# Altium schematic sheet Main.SchDoc
size D; SheetNumber: 1; SheetTotal: 17
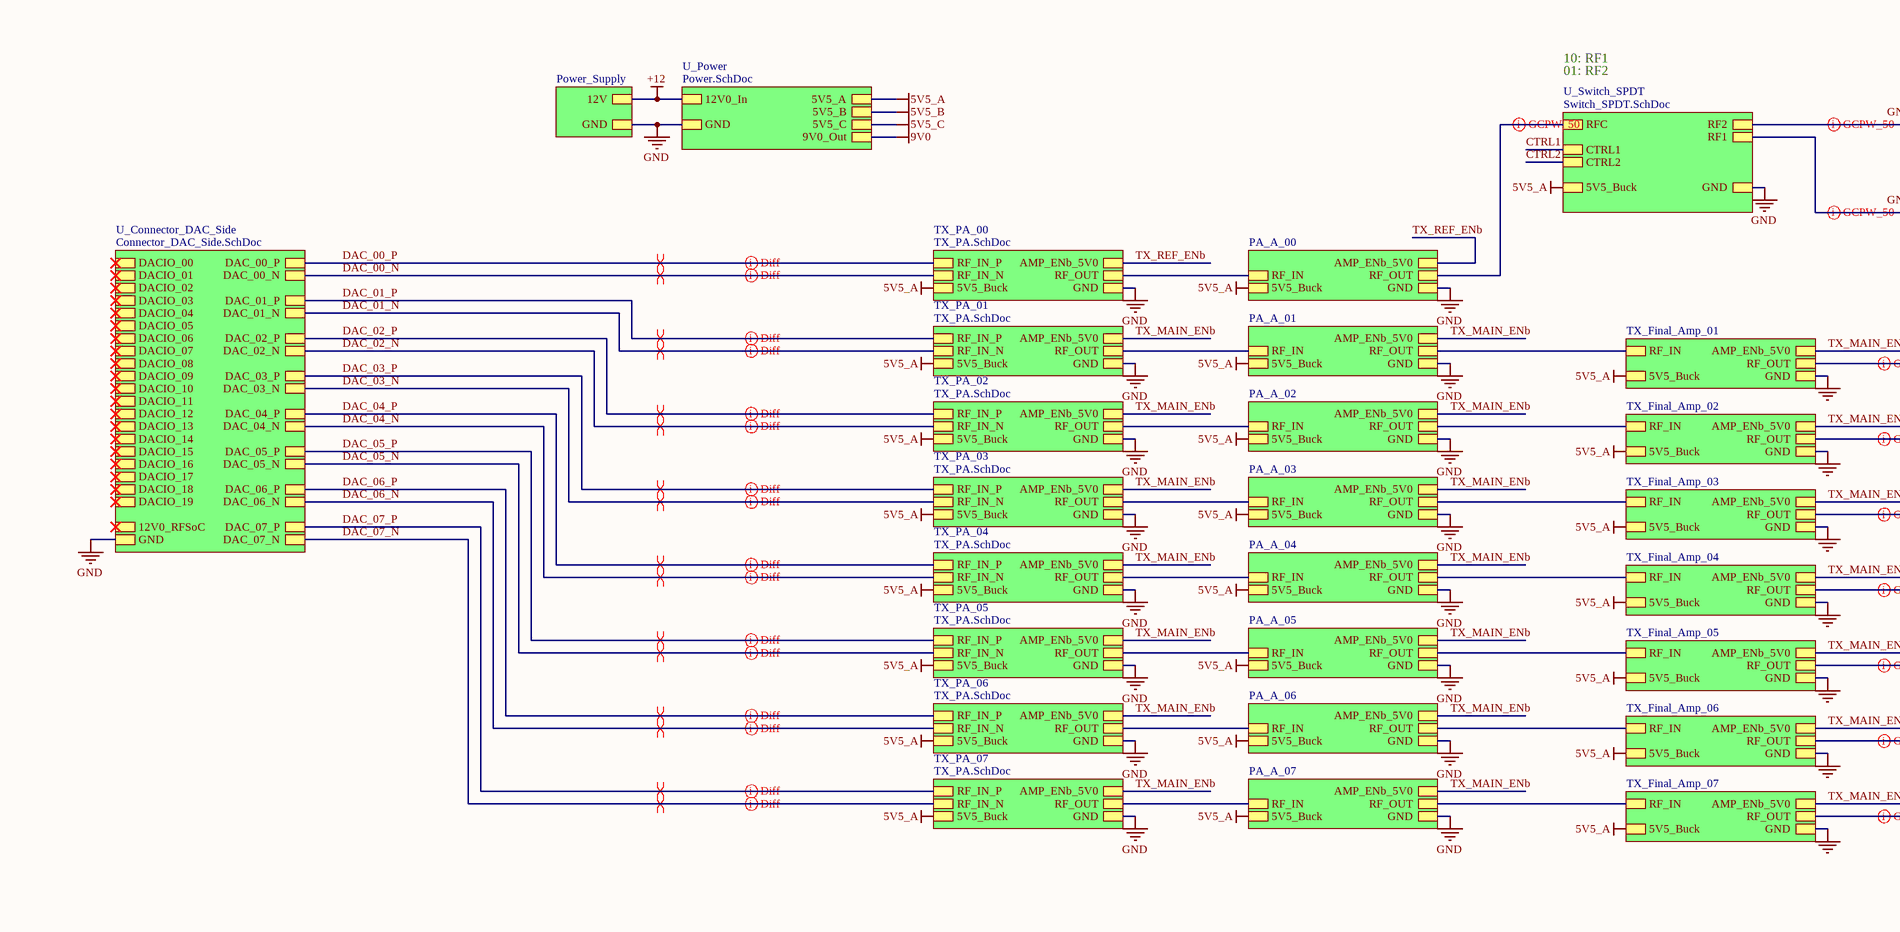
[diagram p0: Main.SchDoc, top left]
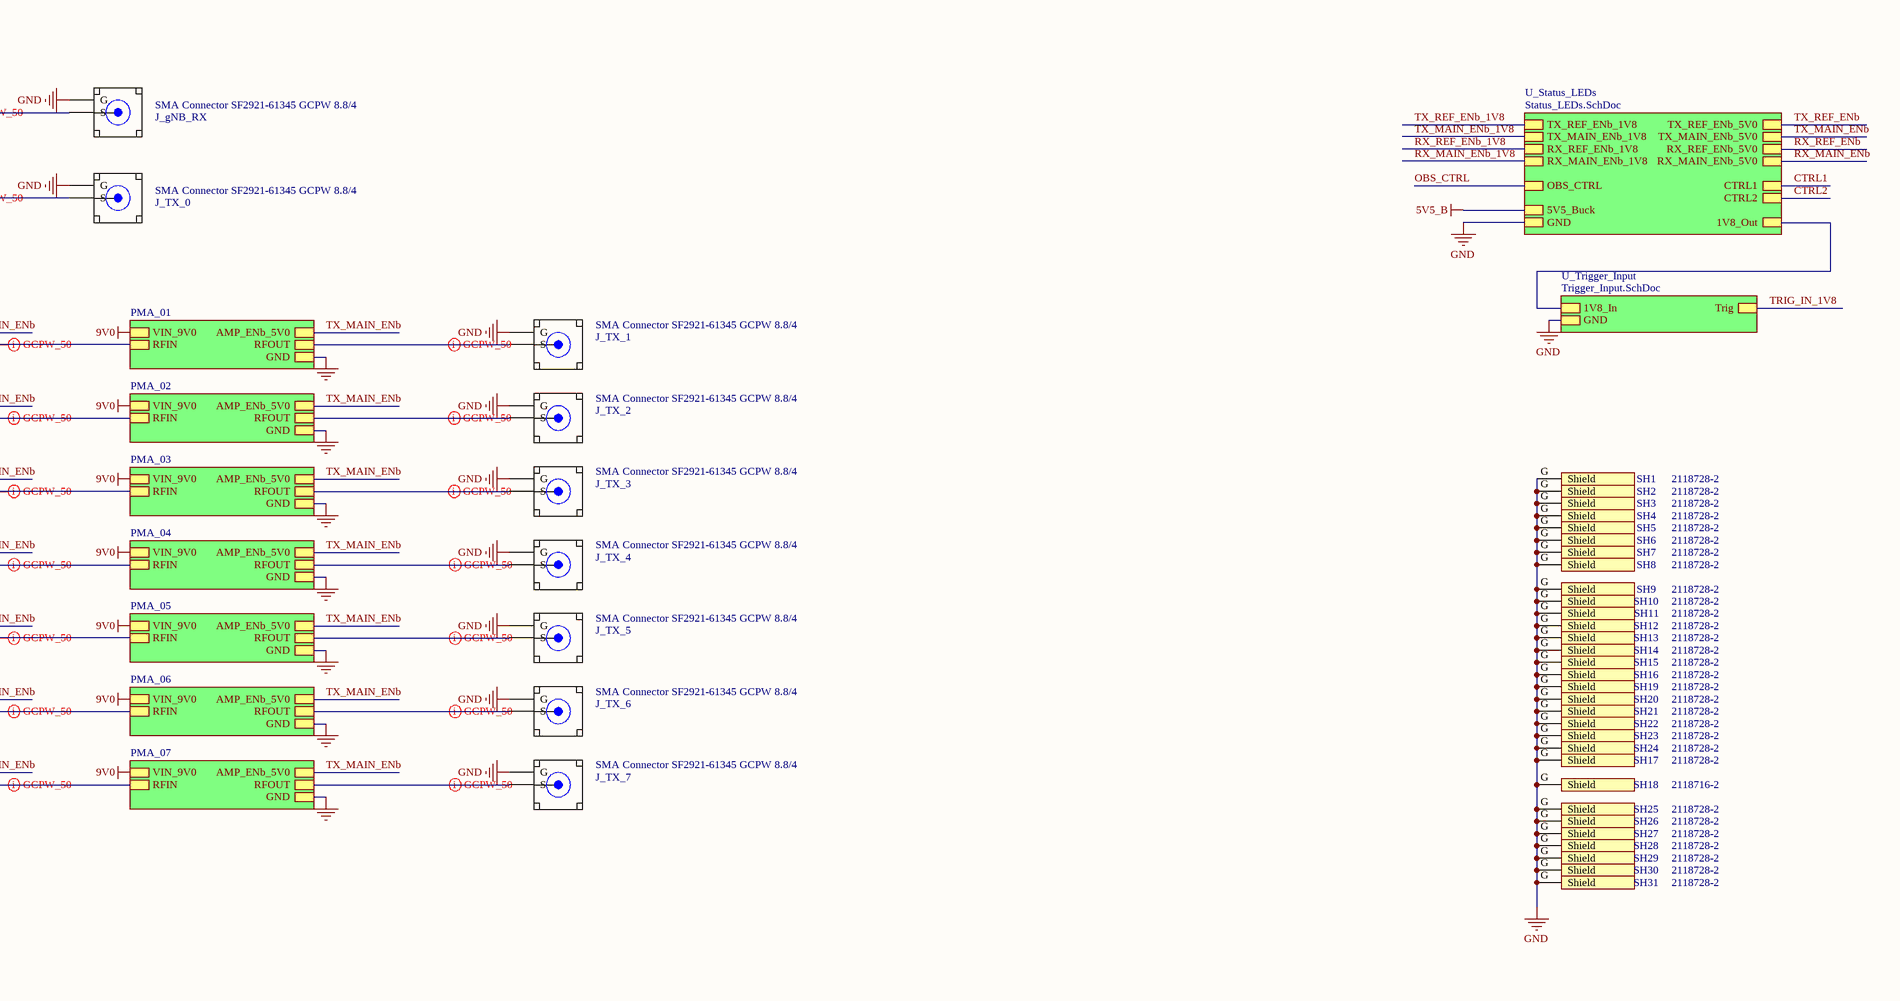
[diagram p1: Main.SchDoc, top right]
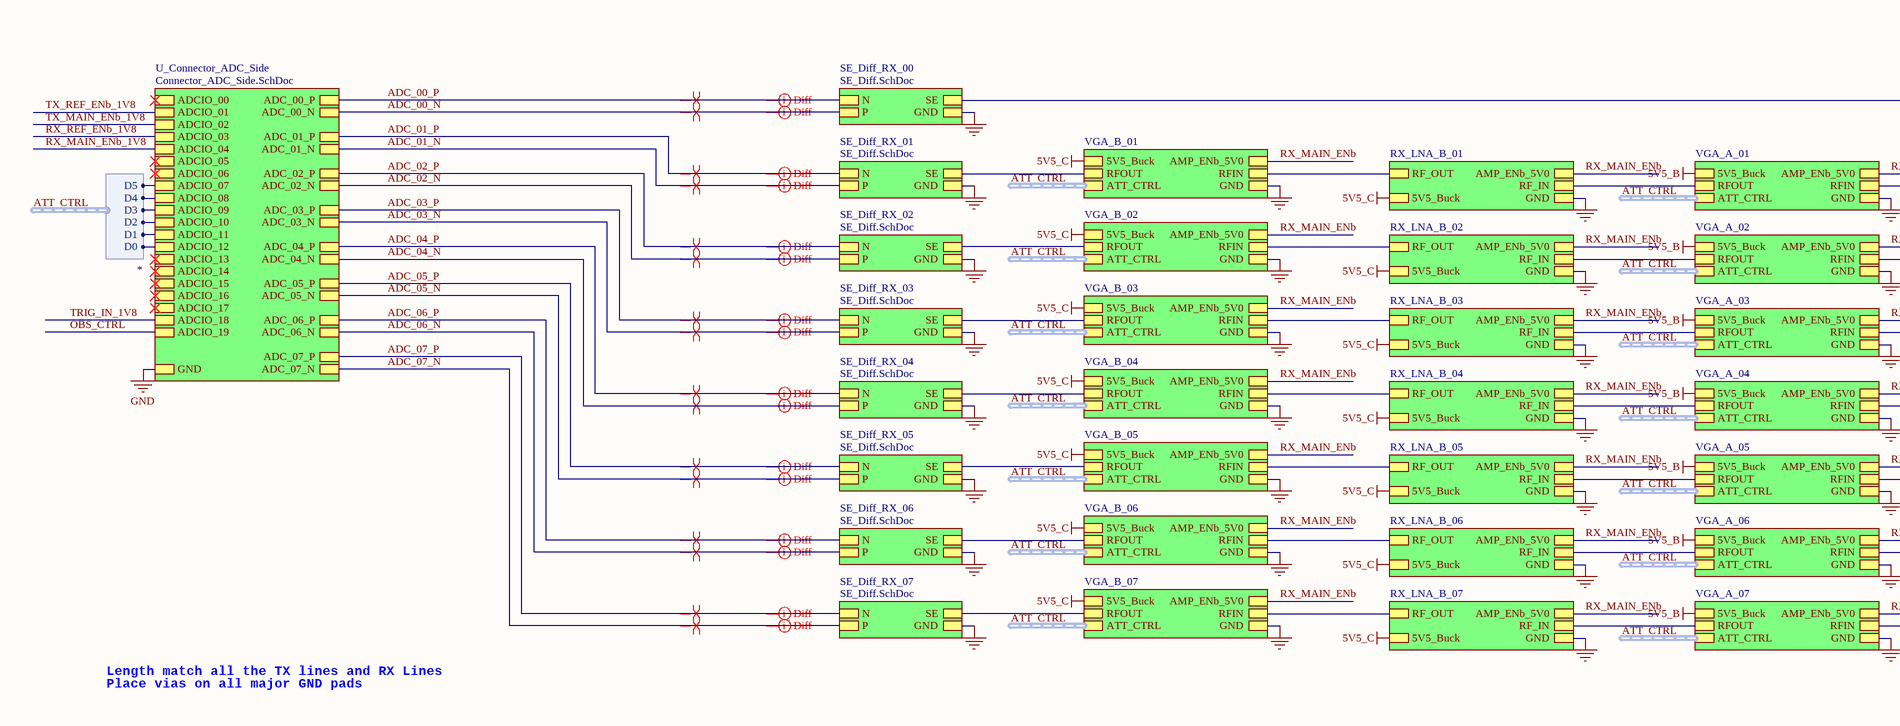
[diagram p2: Main.SchDoc, bottom left]
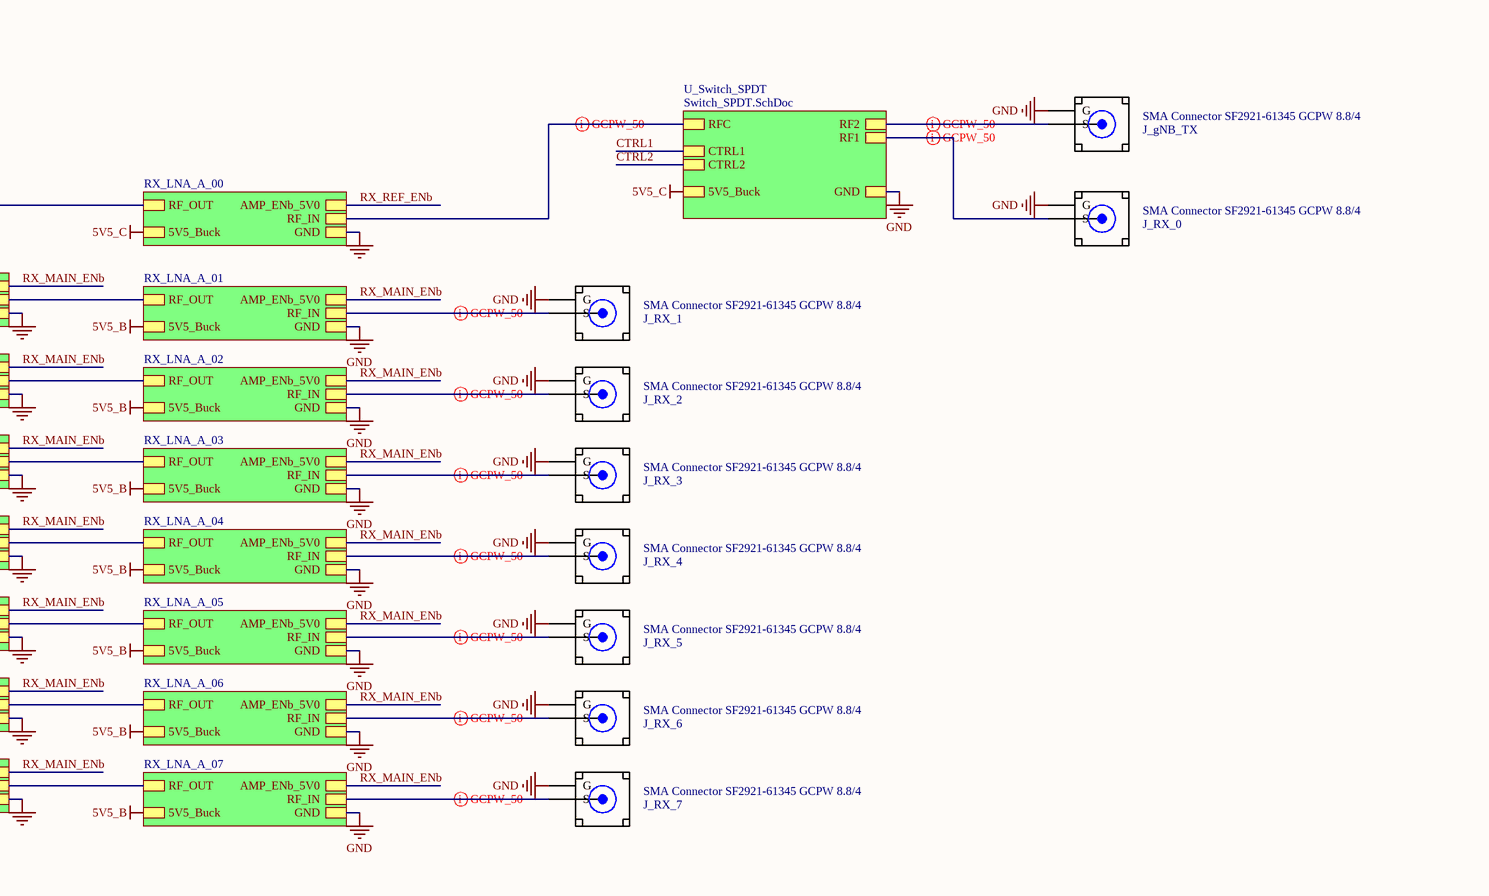
[diagram p3: Main.SchDoc, bottom right]

## Parts
J_gNB_RX  SMA Connector SF2921-61345 GCPW 8.8/4  [amphenol_sv_SF2921-61345 GCPW 8.8 by 4 mil]
J_gNB_TX  SMA Connector SF2921-61345 GCPW 8.8/4  [amphenol_sv_SF2921-61345 GCPW 8.8 by 4 mil]
J_RX_0  SMA Connector SF2921-61345 GCPW 8.8/4  [amphenol_sv_SF2921-61345 GCPW 8.8 by 4 mil]
J_RX_1  SMA Connector SF2921-61345 GCPW 8.8/4  [amphenol_sv_SF2921-61345 GCPW 8.8 by 4 mil]
J_RX_2  SMA Connector SF2921-61345 GCPW 8.8/4  [amphenol_sv_SF2921-61345 GCPW 8.8 by 4 mil]
J_RX_3  SMA Connector SF2921-61345 GCPW 8.8/4  [amphenol_sv_SF2921-61345 GCPW 8.8 by 4 mil]
J_RX_4  SMA Connector SF2921-61345 GCPW 8.8/4  [amphenol_sv_SF2921-61345 GCPW 8.8 by 4 mil]
J_RX_5  SMA Connector SF2921-61345 GCPW 8.8/4  [amphenol_sv_SF2921-61345 GCPW 8.8 by 4 mil]
J_RX_6  SMA Connector SF2921-61345 GCPW 8.8/4  [amphenol_sv_SF2921-61345 GCPW 8.8 by 4 mil]
J_RX_7  SMA Connector SF2921-61345 GCPW 8.8/4  [amphenol_sv_SF2921-61345 GCPW 8.8 by 4 mil]
J_TX_0  SMA Connector SF2921-61345 GCPW 8.8/4  [amphenol_sv_SF2921-61345 GCPW 8.8 by 4 mil]
J_TX_1  SMA Connector SF2921-61345 GCPW 8.8/4  [amphenol_sv_SF2921-61345 GCPW 8.8 by 4 mil]
J_TX_2  SMA Connector SF2921-61345 GCPW 8.8/4  [amphenol_sv_SF2921-61345 GCPW 8.8 by 4 mil]
J_TX_3  SMA Connector SF2921-61345 GCPW 8.8/4  [amphenol_sv_SF2921-61345 GCPW 8.8 by 4 mil]
J_TX_4  SMA Connector SF2921-61345 GCPW 8.8/4  [amphenol_sv_SF2921-61345 GCPW 8.8 by 4 mil]
J_TX_5  SMA Connector SF2921-61345 GCPW 8.8/4  [amphenol_sv_SF2921-61345 GCPW 8.8 by 4 mil]
J_TX_6  SMA Connector SF2921-61345 GCPW 8.8/4  [amphenol_sv_SF2921-61345 GCPW 8.8 by 4 mil]
J_TX_7  SMA Connector SF2921-61345 GCPW 8.8/4  [amphenol_sv_SF2921-61345 GCPW 8.8 by 4 mil]
SH1  2118728-2  [TE_2118728-2]
SH2  2118728-2  [TE_2118728-2]
SH3  2118728-2  [TE_2118728-2]
SH4  2118728-2  [TE_2118728-2]
SH5  2118728-2  [TE_2118728-2]
SH6  2118728-2  [TE_2118728-2]
SH7  2118728-2  [TE_2118728-2]
SH8  2118728-2  [TE_2118728-2]
SH9  2118728-2  [TE_2118728-2]
SH10  2118728-2  [TE_2118728-2]
SH11  2118728-2  [TE_2118728-2]
SH12  2118728-2  [TE_2118728-2]
SH13  2118728-2  [TE_2118728-2]
SH14  2118728-2  [TE_2118728-2]
SH15  2118728-2  [TE_2118728-2]
SH16  2118728-2  [TE_2118728-2]
SH17  2118728-2  [TE_2118728-2]
SH18  2118716-2  [TE_2118716-2]
SH19  2118728-2  [TE_2118728-2]
SH20  2118728-2  [TE_2118728-2]
SH21  2118728-2  [TE_2118728-2]
SH22  2118728-2  [TE_2118728-2]
SH23  2118728-2  [TE_2118728-2]
SH24  2118728-2  [TE_2118728-2]
SH25  2118728-2  [TE_2118728-2]
SH26  2118728-2  [TE_2118728-2]
SH27  2118728-2  [TE_2118728-2]
SH28  2118728-2  [TE_2118728-2]
SH29  2118728-2  [TE_2118728-2]
SH30  2118728-2  [TE_2118728-2]
SH31  2118728-2  [TE_2118728-2]

## Sub-sheets
PA_A_00 = TX_PA_Stage2.SchDoc: RF_IN, 5V5_Buck, GND, RF_OUT, AMP_ENb_5V0
PA_A_01 = TX_PA_Stage2.SchDoc: RF_IN, 5V5_Buck, GND, RF_OUT, AMP_ENb_5V0
PA_A_02 = TX_PA_Stage2.SchDoc: RF_IN, 5V5_Buck, GND, RF_OUT, AMP_ENb_5V0
PA_A_03 = TX_PA_Stage2.SchDoc: RF_IN, 5V5_Buck, GND, RF_OUT, AMP_ENb_5V0
PA_A_04 = TX_PA_Stage2.SchDoc: RF_IN, 5V5_Buck, GND, RF_OUT, AMP_ENb_5V0
PA_A_05 = TX_PA_Stage2.SchDoc: RF_IN, 5V5_Buck, GND, RF_OUT, AMP_ENb_5V0
PA_A_06 = TX_PA_Stage2.SchDoc: RF_IN, 5V5_Buck, GND, RF_OUT, AMP_ENb_5V0
PA_A_07 = TX_PA_Stage2.SchDoc: RF_IN, 5V5_Buck, GND, RF_OUT, AMP_ENb_5V0
PMA_01 = PMA3-83MP+.SchDoc: AMP_ENb_5V0, RFOUT, GND, VIN_9V0, RFIN
PMA_02 = PMA3-83MP+.SchDoc: AMP_ENb_5V0, RFOUT, GND, VIN_9V0, RFIN
PMA_03 = PMA3-83MP+.SchDoc: AMP_ENb_5V0, RFOUT, GND, VIN_9V0, RFIN
PMA_04 = PMA3-83MP+.SchDoc: AMP_ENb_5V0, RFOUT, GND, VIN_9V0, RFIN
PMA_05 = PMA3-83MP+.SchDoc: AMP_ENb_5V0, RFOUT, GND, VIN_9V0, RFIN
PMA_06 = PMA3-83MP+.SchDoc: AMP_ENb_5V0, RFOUT, GND, VIN_9V0, RFIN
PMA_07 = PMA3-83MP+.SchDoc: AMP_ENb_5V0, RFOUT, GND, VIN_9V0, RFIN
Power_Supply = Power_Supply.SchDoc: GND, 12V
RX_LNA_A_00 = RX_LNA.SchDoc: RF_IN, 5V5_Buck, GND, AMP_ENb_5V0, RF_OUT
RX_LNA_A_01 = RX_LNA.SchDoc: RF_IN, 5V5_Buck, GND, AMP_ENb_5V0, RF_OUT
RX_LNA_A_02 = RX_LNA.SchDoc: RF_IN, 5V5_Buck, GND, AMP_ENb_5V0, RF_OUT
RX_LNA_A_03 = RX_LNA.SchDoc: RF_IN, 5V5_Buck, GND, AMP_ENb_5V0, RF_OUT
RX_LNA_A_04 = RX_LNA.SchDoc: RF_IN, 5V5_Buck, GND, AMP_ENb_5V0, RF_OUT
RX_LNA_A_05 = RX_LNA.SchDoc: RF_IN, 5V5_Buck, GND, AMP_ENb_5V0, RF_OUT
RX_LNA_A_06 = RX_LNA.SchDoc: RF_IN, 5V5_Buck, GND, AMP_ENb_5V0, RF_OUT
RX_LNA_A_07 = RX_LNA.SchDoc: RF_IN, 5V5_Buck, GND, AMP_ENb_5V0, RF_OUT
RX_LNA_B_01 = RX_LNA.SchDoc: RF_IN, 5V5_Buck, GND, AMP_ENb_5V0, RF_OUT
RX_LNA_B_02 = RX_LNA.SchDoc: RF_IN, 5V5_Buck, GND, AMP_ENb_5V0, RF_OUT
RX_LNA_B_03 = RX_LNA.SchDoc: RF_IN, 5V5_Buck, GND, AMP_ENb_5V0, RF_OUT
RX_LNA_B_04 = RX_LNA.SchDoc: RF_IN, 5V5_Buck, GND, AMP_ENb_5V0, RF_OUT
RX_LNA_B_05 = RX_LNA.SchDoc: RF_IN, 5V5_Buck, GND, AMP_ENb_5V0, RF_OUT
RX_LNA_B_06 = RX_LNA.SchDoc: RF_IN, 5V5_Buck, GND, AMP_ENb_5V0, RF_OUT
RX_LNA_B_07 = RX_LNA.SchDoc: RF_IN, 5V5_Buck, GND, AMP_ENb_5V0, RF_OUT
SE_Diff_RX_00 = SE_Diff.SchDoc: SE, GND, N, P
SE_Diff_RX_01 = SE_Diff.SchDoc: SE, GND, N, P
SE_Diff_RX_02 = SE_Diff.SchDoc: SE, GND, N, P
SE_Diff_RX_03 = SE_Diff.SchDoc: SE, GND, N, P
SE_Diff_RX_04 = SE_Diff.SchDoc: SE, GND, N, P
SE_Diff_RX_05 = SE_Diff.SchDoc: SE, GND, N, P
SE_Diff_RX_06 = SE_Diff.SchDoc: SE, GND, N, P
SE_Diff_RX_07 = SE_Diff.SchDoc: SE, GND, N, P
TX_Final_Amp_01 = RX_LNA.SchDoc: RF_IN, GND, 5V5_Buck, AMP_ENb_5V0, RF_OUT
TX_Final_Amp_02 = RX_LNA.SchDoc: RF_IN, GND, 5V5_Buck, AMP_ENb_5V0, RF_OUT
TX_Final_Amp_03 = RX_LNA.SchDoc: RF_IN, GND, 5V5_Buck, AMP_ENb_5V0, RF_OUT
TX_Final_Amp_04 = RX_LNA.SchDoc: RF_IN, GND, 5V5_Buck, AMP_ENb_5V0, RF_OUT
TX_Final_Amp_05 = RX_LNA.SchDoc: RF_IN, GND, 5V5_Buck, AMP_ENb_5V0, RF_OUT
TX_Final_Amp_06 = RX_LNA.SchDoc: RF_IN, GND, 5V5_Buck, AMP_ENb_5V0, RF_OUT
TX_Final_Amp_07 = RX_LNA.SchDoc: RF_IN, GND, 5V5_Buck, AMP_ENb_5V0, RF_OUT
TX_PA_00 = TX_PA.SchDoc: RF_OUT, GND, 5V5_Buck, RF_IN_P, RF_IN_N, AMP_ENb_5V0
TX_PA_01 = TX_PA.SchDoc: RF_OUT, GND, 5V5_Buck, RF_IN_P, RF_IN_N, AMP_ENb_5V0
TX_PA_02 = TX_PA.SchDoc: RF_OUT, GND, 5V5_Buck, RF_IN_P, RF_IN_N, AMP_ENb_5V0
TX_PA_03 = TX_PA.SchDoc: RF_OUT, GND, 5V5_Buck, RF_IN_P, RF_IN_N, AMP_ENb_5V0
TX_PA_04 = TX_PA.SchDoc: RF_OUT, GND, 5V5_Buck, RF_IN_P, RF_IN_N, AMP_ENb_5V0
TX_PA_05 = TX_PA.SchDoc: RF_OUT, GND, 5V5_Buck, RF_IN_P, RF_IN_N, AMP_ENb_5V0
TX_PA_06 = TX_PA.SchDoc: RF_OUT, GND, 5V5_Buck, RF_IN_P, RF_IN_N, AMP_ENb_5V0
TX_PA_07 = TX_PA.SchDoc: RF_OUT, GND, 5V5_Buck, RF_IN_P, RF_IN_N, AMP_ENb_5V0
U_Connector_ADC_Side = Connector_ADC_Side.SchDoc: ADCIO_00, ADCIO_01, ADCIO_02, ADCIO_03, ADCIO_04, ADCIO_05, ADCIO_06, ADCIO_07, ADCIO_08, ADCIO_09, ADCIO_10, ADCIO_11, ADCIO_12, ADCIO_13, ADCIO_14, ADCIO_15, ADCIO_16, ADCIO_17, ADCIO_18, ADCIO_19, ADC_00_P, ADC_00_N, ADC_01_P, ADC_01_N, ADC_02_P, ADC_02_N, ADC_03_P, ADC_03_N, ADC_04_P, ADC_04_N, ADC_05_P, ADC_05_N, ADC_06_P, ADC_06_N, ADC_07_P, ADC_07_N, GND
U_Connector_DAC_Side = Connector_DAC_Side.SchDoc: DACIO_00, DACIO_01, DACIO_02, DACIO_03, DACIO_04, DACIO_05, DACIO_06, DACIO_07, DACIO_08, DACIO_09, DACIO_10, DACIO_11, DACIO_12, DACIO_13, DACIO_14, DACIO_15, DACIO_16, DACIO_17, DACIO_18, DACIO_19, DAC_00_P, DAC_00_N, DAC_01_P, DAC_01_N, DAC_02_P, DAC_02_N, DAC_03_P, DAC_03_N, DAC_04_P, DAC_04_N, DAC_05_P, DAC_05_N, DAC_06_P, DAC_06_N, DAC_07_P, DAC_07_N, GND, 12V0_RFSoC
U_Power = Power.SchDoc: 12V0_In, GND, 5V5_A, 5V5_B, 5V5_C, 9V0_Out
U_Status_LEDs = Status_LEDs.SchDoc: 5V5_Buck, GND, OBS_CTRL, CTRL1, CTRL2, 1V8_Out, TX_REF_ENb_1V8, TX_MAIN_ENb_1V8, RX_REF_ENb_1V8, RX_MAIN_ENb_1V8, TX_REF_ENb_5V0, TX_MAIN_ENb_5V0, RX_REF_ENb_5V0, RX_MAIN_ENb_5V0
U_Switch_SPDT = Switch_SPDT.SchDoc: RFC, CTRL1, CTRL2, 5V5_Buck, GND, RF2, RF1
U_Switch_SPDT = Switch_SPDT.SchDoc: RFC, CTRL1, CTRL2, 5V5_Buck, GND, RF2, RF1
U_Trigger_Input = Trigger_Input.SchDoc: 1V8_In, Trig, GND
VGA_A_01 = HMC625_VGA.SchDoc: AMP_ENb_5V0, 5V5_Buck, RFIN, RFOUT, GND, ATT_CTRL (harness *)
VGA_A_02 = HMC625_VGA.SchDoc: AMP_ENb_5V0, 5V5_Buck, RFIN, RFOUT, GND, ATT_CTRL (harness *)
VGA_A_03 = HMC625_VGA.SchDoc: AMP_ENb_5V0, 5V5_Buck, RFIN, RFOUT, GND, ATT_CTRL (harness *)
VGA_A_04 = HMC625_VGA.SchDoc: AMP_ENb_5V0, 5V5_Buck, RFIN, RFOUT, GND, ATT_CTRL (harness *)
VGA_A_05 = HMC625_VGA.SchDoc: AMP_ENb_5V0, 5V5_Buck, RFIN, RFOUT, GND, ATT_CTRL (harness *)
VGA_A_06 = HMC625_VGA.SchDoc: AMP_ENb_5V0, 5V5_Buck, RFIN, RFOUT, GND, ATT_CTRL (harness *)
VGA_A_07 = HMC625_VGA.SchDoc: AMP_ENb_5V0, 5V5_Buck, RFIN, RFOUT, GND, ATT_CTRL (harness *)
VGA_B_01 = HMC625_VGA.SchDoc: AMP_ENb_5V0, 5V5_Buck, RFIN, RFOUT, GND, ATT_CTRL (harness *)
VGA_B_02 = HMC625_VGA.SchDoc: AMP_ENb_5V0, 5V5_Buck, RFIN, RFOUT, GND, ATT_CTRL (harness *)
VGA_B_03 = HMC625_VGA.SchDoc: AMP_ENb_5V0, 5V5_Buck, RFIN, RFOUT, GND, ATT_CTRL (harness *)
VGA_B_04 = HMC625_VGA.SchDoc: AMP_ENb_5V0, 5V5_Buck, RFIN, RFOUT, GND, ATT_CTRL (harness *)
VGA_B_05 = HMC625_VGA.SchDoc: AMP_ENb_5V0, 5V5_Buck, RFIN, RFOUT, GND, ATT_CTRL (harness *)
VGA_B_06 = HMC625_VGA.SchDoc: AMP_ENb_5V0, 5V5_Buck, RFIN, RFOUT, GND, ATT_CTRL (harness *)
VGA_B_07 = HMC625_VGA.SchDoc: AMP_ENb_5V0, 5V5_Buck, RFIN, RFOUT, GND, ATT_CTRL (harness *)

## Harnesses
*: D0, D1, D2, D3, D4, D5

## Nets
5V5_A: sheet TX_PA_00/5V5_Buck, sheet TX_PA_01/5V5_Buck, sheet TX_PA_02/5V5_Buck, sheet TX_PA_03/5V5_Buck, sheet TX_PA_04/5V5_Buck, sheet TX_PA_05/5V5_Buck, sheet TX_PA_06/5V5_Buck, sheet TX_PA_07/5V5_Buck, sheet U_Power/5V5_A, sheet PA_A_00/5V5_Buck, sheet PA_A_01/5V5_Buck, sheet PA_A_02/5V5_Buck, sheet PA_A_03/5V5_Buck, sheet PA_A_04/5V5_Buck, sheet PA_A_05/5V5_Buck, sheet PA_A_06/5V5_Buck, sheet PA_A_07/5V5_Buck, sheet U_Switch_SPDT/5V5_Buck, sheet TX_Final_Amp_01/5V5_Buck, sheet TX_Final_Amp_02/5V5_Buck, sheet TX_Final_Amp_03/5V5_Buck, sheet TX_Final_Amp_04/5V5_Buck, sheet TX_Final_Amp_05/5V5_Buck, sheet TX_Final_Amp_06/5V5_Buck, sheet TX_Final_Amp_07/5V5_Buck
5V5_B: sheet RX_LNA_A_01/5V5_Buck, sheet RX_LNA_A_02/5V5_Buck, sheet RX_LNA_A_03/5V5_Buck, sheet RX_LNA_A_04/5V5_Buck, sheet RX_LNA_A_05/5V5_Buck, sheet RX_LNA_A_06/5V5_Buck, sheet RX_LNA_A_07/5V5_Buck, sheet U_Power/5V5_B, sheet U_Status_LEDs/5V5_Buck, sheet VGA_A_01/5V5_Buck, sheet VGA_A_02/5V5_Buck, sheet VGA_A_03/5V5_Buck, sheet VGA_A_04/5V5_Buck, sheet VGA_A_05/5V5_Buck, sheet VGA_A_06/5V5_Buck, sheet VGA_A_07/5V5_Buck
5V5_C: sheet RX_LNA_A_00/5V5_Buck, sheet U_Power/5V5_C, sheet U_Switch_SPDT/5V5_Buck, sheet RX_LNA_B_01/5V5_Buck, sheet RX_LNA_B_02/5V5_Buck, sheet RX_LNA_B_03/5V5_Buck, sheet RX_LNA_B_04/5V5_Buck, sheet RX_LNA_B_05/5V5_Buck, sheet RX_LNA_B_06/5V5_Buck, sheet RX_LNA_B_07/5V5_Buck, sheet VGA_B_01/5V5_Buck, sheet VGA_B_02/5V5_Buck, sheet VGA_B_03/5V5_Buck, sheet VGA_B_04/5V5_Buck, sheet VGA_B_05/5V5_Buck, sheet VGA_B_06/5V5_Buck, sheet VGA_B_07/5V5_Buck
9V0: sheet U_Power/9V0_Out, sheet PMA_01/VIN_9V0, sheet PMA_02/VIN_9V0, sheet PMA_03/VIN_9V0, sheet PMA_04/VIN_9V0, sheet PMA_05/VIN_9V0, sheet PMA_06/VIN_9V0, sheet PMA_07/VIN_9V0
+12: sheet U_Power/12V0_In, sheet Power_Supply/12V
GND: J_gNB_RX.G J_gNB_TX.G J_RX_0.G J_RX_1.G J_RX_2.G J_RX_3.G J_RX_4.G J_RX_5.G J_RX_6.G J_RX_7.G J_TX_0.G J_TX_1.G J_TX_2.G J_TX_3.G J_TX_4.G J_TX_5.G J_TX_6.G J_TX_7.G SH1.G(Shield) SH2.G(Shield) SH3.G(Shield) SH4.G(Shield) SH5.G(Shield) SH6.G(Shield) SH7.G(Shield) SH8.G(Shield) SH9.G(Shield) SH10.G(Shield) SH11.G(Shield) SH12.G(Shield) SH13.G(Shield) SH14.G(Shield) SH15.G(Shield) SH16.G(Shield) SH17.G(Shield) SH18.G(Shield) SH19.G(Shield) SH20.G(Shield) SH21.G(Shield) SH22.G(Shield) SH23.G(Shield) SH24.G(Shield) SH25.G(Shield) SH26.G(Shield) SH27.G(Shield) SH28.G(Shield) SH29.G(Shield) SH30.G(Shield) SH31.G(Shield) ; sheet U_Connector_DAC_Side/GND, sheet U_Connector_ADC_Side/GND, sheet RX_LNA_A_01/GND, sheet RX_LNA_A_02/GND, sheet RX_LNA_A_03/GND, sheet RX_LNA_A_04/GND, sheet RX_LNA_A_05/GND, sheet RX_LNA_A_06/GND, sheet RX_LNA_A_07/GND, sheet RX_LNA_A_00/GND, sheet TX_PA_00/GND, sheet TX_PA_01/GND, sheet TX_PA_02/GND, sheet TX_PA_03/GND, sheet TX_PA_04/GND, sheet TX_PA_05/GND, sheet TX_PA_06/GND, sheet TX_PA_07/GND, sheet U_Power/GND, sheet PA_A_00/GND, sheet PA_A_01/GND, sheet PA_A_02/GND, sheet PA_A_03/GND, sheet PA_A_04/GND, sheet PA_A_05/GND, sheet PA_A_06/GND, sheet PA_A_07/GND, sheet U_Switch_SPDT/GND, sheet U_Switch_SPDT/GND, sheet U_Status_LEDs/GND, sheet U_Trigger_Input/GND, sheet SE_Diff_RX_00/GND, sheet SE_Diff_RX_01/GND, sheet SE_Diff_RX_02/GND, sheet SE_Diff_RX_03/GND, sheet SE_Diff_RX_04/GND, sheet SE_Diff_RX_05/GND, sheet SE_Diff_RX_06/GND, sheet SE_Diff_RX_07/GND, sheet RX_LNA_B_01/GND, sheet RX_LNA_B_02/GND, sheet RX_LNA_B_03/GND, sheet RX_LNA_B_04/GND, sheet RX_LNA_B_05/GND, sheet RX_LNA_B_06/GND, sheet RX_LNA_B_07/GND, sheet VGA_A_01/GND, sheet VGA_A_02/GND, sheet VGA_A_03/GND, sheet VGA_A_04/GND, sheet VGA_A_05/GND, sheet VGA_A_06/GND, sheet VGA_A_07/GND, sheet VGA_B_01/GND, sheet VGA_B_02/GND, sheet VGA_B_03/GND, sheet VGA_B_04/GND, sheet VGA_B_05/GND, sheet VGA_B_06/GND, sheet VGA_B_07/GND, sheet TX_Final_Amp_01/GND, sheet TX_Final_Amp_02/GND, sheet TX_Final_Amp_03/GND, sheet TX_Final_Amp_04/GND, sheet TX_Final_Amp_05/GND, sheet TX_Final_Amp_06/GND, sheet TX_Final_Amp_07/GND, sheet PMA_01/GND, sheet PMA_02/GND, sheet PMA_03/GND, sheet PMA_04/GND, sheet PMA_05/GND, sheet PMA_06/GND, sheet PMA_07/GND, sheet Power_Supply/GND
ADC_00_N: sheet U_Connector_ADC_Side/ADC_00_N, sheet SE_Diff_RX_00/P
ADC_00_P: sheet U_Connector_ADC_Side/ADC_00_P, sheet SE_Diff_RX_00/N
ADC_01_N: sheet U_Connector_ADC_Side/ADC_01_N, sheet SE_Diff_RX_01/P
ADC_01_P: sheet U_Connector_ADC_Side/ADC_01_P, sheet SE_Diff_RX_01/N
ADC_02_N: sheet U_Connector_ADC_Side/ADC_02_N, sheet SE_Diff_RX_02/P
ADC_02_P: sheet U_Connector_ADC_Side/ADC_02_P, sheet SE_Diff_RX_02/N
ADC_03_N: sheet U_Connector_ADC_Side/ADC_03_N, sheet SE_Diff_RX_03/P
ADC_03_P: sheet U_Connector_ADC_Side/ADC_03_P, sheet SE_Diff_RX_03/N
ADC_04_N: sheet U_Connector_ADC_Side/ADC_04_N, sheet SE_Diff_RX_04/P
ADC_04_P: sheet U_Connector_ADC_Side/ADC_04_P, sheet SE_Diff_RX_04/N
ADC_05_N: sheet U_Connector_ADC_Side/ADC_05_N, sheet SE_Diff_RX_05/P
ADC_05_P: sheet U_Connector_ADC_Side/ADC_05_P, sheet SE_Diff_RX_05/N
ADC_06_N: sheet U_Connector_ADC_Side/ADC_06_N, sheet SE_Diff_RX_06/P
ADC_06_P: sheet U_Connector_ADC_Side/ADC_06_P, sheet SE_Diff_RX_06/N
ADC_07_N: sheet U_Connector_ADC_Side/ADC_07_N, sheet SE_Diff_RX_07/P
ADC_07_P: sheet U_Connector_ADC_Side/ADC_07_P, sheet SE_Diff_RX_07/N
ATT_CTRL.D0: sheet U_Connector_ADC_Side/ADCIO_12, sheet VGA_A_01/ATT_CTRL.D0
ATT_CTRL.D1: sheet U_Connector_ADC_Side/ADCIO_11, sheet VGA_A_01/ATT_CTRL.D1
ATT_CTRL.D2: sheet U_Connector_ADC_Side/ADCIO_10, sheet VGA_A_01/ATT_CTRL.D2
ATT_CTRL.D3: sheet U_Connector_ADC_Side/ADCIO_09, sheet VGA_A_01/ATT_CTRL.D3
ATT_CTRL.D4: sheet U_Connector_ADC_Side/ADCIO_08, sheet VGA_A_01/ATT_CTRL.D4
ATT_CTRL.D5: sheet U_Connector_ADC_Side/ADCIO_07, sheet VGA_A_01/ATT_CTRL.D5
CTRL1: sheet U_Switch_SPDT/CTRL1, sheet U_Switch_SPDT/CTRL1, sheet U_Status_LEDs/CTRL1
CTRL2: sheet U_Switch_SPDT/CTRL2, sheet U_Switch_SPDT/CTRL2, sheet U_Status_LEDs/CTRL2
DAC_00_N: sheet U_Connector_DAC_Side/DAC_00_N, sheet TX_PA_00/RF_IN_N
DAC_00_P: sheet U_Connector_DAC_Side/DAC_00_P, sheet TX_PA_00/RF_IN_P
DAC_01_N: sheet U_Connector_DAC_Side/DAC_01_N, sheet TX_PA_01/RF_IN_N
DAC_01_P: sheet U_Connector_DAC_Side/DAC_01_P, sheet TX_PA_01/RF_IN_P
DAC_02_N: sheet U_Connector_DAC_Side/DAC_02_N, sheet TX_PA_02/RF_IN_N
DAC_02_P: sheet U_Connector_DAC_Side/DAC_02_P, sheet TX_PA_02/RF_IN_P
DAC_03_N: sheet U_Connector_DAC_Side/DAC_03_N, sheet TX_PA_03/RF_IN_N
DAC_03_P: sheet U_Connector_DAC_Side/DAC_03_P, sheet TX_PA_03/RF_IN_P
DAC_04_N: sheet U_Connector_DAC_Side/DAC_04_N, sheet TX_PA_04/RF_IN_N
DAC_04_P: sheet U_Connector_DAC_Side/DAC_04_P, sheet TX_PA_04/RF_IN_P
DAC_05_N: sheet U_Connector_DAC_Side/DAC_05_N, sheet TX_PA_05/RF_IN_N
DAC_05_P: sheet U_Connector_DAC_Side/DAC_05_P, sheet TX_PA_05/RF_IN_P
DAC_06_N: sheet U_Connector_DAC_Side/DAC_06_N, sheet TX_PA_06/RF_IN_N
DAC_06_P: sheet U_Connector_DAC_Side/DAC_06_P, sheet TX_PA_06/RF_IN_P
DAC_07_N: sheet U_Connector_DAC_Side/DAC_07_N, sheet TX_PA_07/RF_IN_N
DAC_07_P: sheet U_Connector_DAC_Side/DAC_07_P, sheet TX_PA_07/RF_IN_P
OBS_CTRL: sheet U_Connector_ADC_Side/ADCIO_19, sheet U_Status_LEDs/OBS_CTRL
RX_MAIN_ENb: sheet RX_LNA_A_01/AMP_ENb_5V0, sheet RX_LNA_A_02/AMP_ENb_5V0, sheet RX_LNA_A_03/AMP_ENb_5V0, sheet RX_LNA_A_04/AMP_ENb_5V0, sheet RX_LNA_A_05/AMP_ENb_5V0, sheet RX_LNA_A_06/AMP_ENb_5V0, sheet RX_LNA_A_07/AMP_ENb_5V0, sheet U_Status_LEDs/RX_MAIN_ENb_5V0, sheet RX_LNA_B_01/AMP_ENb_5V0, sheet RX_LNA_B_02/AMP_ENb_5V0, sheet RX_LNA_B_03/AMP_ENb_5V0, sheet RX_LNA_B_04/AMP_ENb_5V0, sheet RX_LNA_B_05/AMP_ENb_5V0, sheet RX_LNA_B_06/AMP_ENb_5V0, sheet RX_LNA_B_07/AMP_ENb_5V0, sheet VGA_A_01/AMP_ENb_5V0, sheet VGA_A_02/AMP_ENb_5V0, sheet VGA_A_03/AMP_ENb_5V0, sheet VGA_A_04/AMP_ENb_5V0, sheet VGA_A_05/AMP_ENb_5V0, sheet VGA_A_06/AMP_ENb_5V0, sheet VGA_A_07/AMP_ENb_5V0, sheet VGA_B_01/AMP_ENb_5V0, sheet VGA_B_02/AMP_ENb_5V0, sheet VGA_B_03/AMP_ENb_5V0, sheet VGA_B_04/AMP_ENb_5V0, sheet VGA_B_05/AMP_ENb_5V0, sheet VGA_B_06/AMP_ENb_5V0, sheet VGA_B_07/AMP_ENb_5V0
RX_MAIN_ENb_1V8: sheet U_Connector_ADC_Side/ADCIO_04, sheet U_Status_LEDs/RX_MAIN_ENb_1V8
RX_REF_ENb: sheet RX_LNA_A_00/AMP_ENb_5V0, sheet U_Status_LEDs/RX_REF_ENb_5V0
RX_REF_ENb_1V8: sheet U_Connector_ADC_Side/ADCIO_03, sheet U_Status_LEDs/RX_REF_ENb_1V8
TRIG_IN_1V8: sheet U_Connector_ADC_Side/ADCIO_18, sheet U_Trigger_Input/Trig
TX_MAIN_ENb: sheet TX_PA_01/AMP_ENb_5V0, sheet TX_PA_02/AMP_ENb_5V0, sheet TX_PA_03/AMP_ENb_5V0, sheet TX_PA_04/AMP_ENb_5V0, sheet TX_PA_05/AMP_ENb_5V0, sheet TX_PA_06/AMP_ENb_5V0, sheet TX_PA_07/AMP_ENb_5V0, sheet PA_A_01/AMP_ENb_5V0, sheet PA_A_02/AMP_ENb_5V0, sheet PA_A_03/AMP_ENb_5V0, sheet PA_A_04/AMP_ENb_5V0, sheet PA_A_05/AMP_ENb_5V0, sheet PA_A_06/AMP_ENb_5V0, sheet PA_A_07/AMP_ENb_5V0, sheet U_Status_LEDs/TX_MAIN_ENb_5V0, sheet TX_Final_Amp_01/AMP_ENb_5V0, sheet TX_Final_Amp_02/AMP_ENb_5V0, sheet TX_Final_Amp_03/AMP_ENb_5V0, sheet TX_Final_Amp_04/AMP_ENb_5V0, sheet TX_Final_Amp_05/AMP_ENb_5V0, sheet TX_Final_Amp_06/AMP_ENb_5V0, sheet TX_Final_Amp_07/AMP_ENb_5V0, sheet PMA_01/AMP_ENb_5V0, sheet PMA_02/AMP_ENb_5V0, sheet PMA_03/AMP_ENb_5V0, sheet PMA_04/AMP_ENb_5V0, sheet PMA_05/AMP_ENb_5V0, sheet PMA_06/AMP_ENb_5V0, sheet PMA_07/AMP_ENb_5V0
TX_MAIN_ENb_1V8: sheet U_Connector_ADC_Side/ADCIO_02, sheet U_Status_LEDs/TX_MAIN_ENb_1V8
TX_REF_ENb: sheet TX_PA_00/AMP_ENb_5V0, sheet PA_A_00/AMP_ENb_5V0, sheet U_Status_LEDs/TX_REF_ENb_5V0
TX_REF_ENb_1V8: sheet U_Connector_ADC_Side/ADCIO_01, sheet U_Status_LEDs/TX_REF_ENb_1V8
NetJ_gNB_RX_S: J_gNB_RX.S ; sheet U_Switch_SPDT/RF2
NetJ_gNB_TX_S: J_gNB_TX.S ; sheet U_Switch_SPDT/RF2
NetJ_RX_0_S: J_RX_0.S ; sheet U_Switch_SPDT/RF1
NetJ_RX_1_S: J_RX_1.S ; sheet RX_LNA_A_01/RF_IN
NetJ_RX_2_S: J_RX_2.S ; sheet RX_LNA_A_02/RF_IN
NetJ_RX_3_S: J_RX_3.S ; sheet RX_LNA_A_03/RF_IN
NetJ_RX_4_S: J_RX_4.S ; sheet RX_LNA_A_04/RF_IN
NetJ_RX_5_S: J_RX_5.S ; sheet RX_LNA_A_05/RF_IN
NetJ_RX_6_S: J_RX_6.S ; sheet RX_LNA_A_06/RF_IN
NetJ_RX_7_S: J_RX_7.S ; sheet RX_LNA_A_07/RF_IN
NetJ_TX_0_S: J_TX_0.S ; sheet U_Switch_SPDT/RF1
NetJ_TX_1_S: J_TX_1.S ; sheet PMA_01/RFOUT
NetJ_TX_2_S: J_TX_2.S ; sheet PMA_02/RFOUT
NetJ_TX_3_S: J_TX_3.S ; sheet PMA_03/RFOUT
NetJ_TX_4_S: J_TX_4.S ; sheet PMA_04/RFOUT
NetJ_TX_5_S: J_TX_5.S ; sheet PMA_05/RFOUT
NetJ_TX_6_S: J_TX_6.S ; sheet PMA_06/RFOUT
NetJ_TX_7_S: J_TX_7.S ; sheet PMA_07/RFOUT
(unnamed): sheet RX_LNA_A_01/RF_OUT, sheet VGA_A_01/RFIN
(unnamed): sheet RX_LNA_A_02/RF_OUT, sheet VGA_A_02/RFIN
(unnamed): sheet RX_LNA_A_03/RF_OUT, sheet VGA_A_03/RFIN
(unnamed): sheet RX_LNA_A_04/RF_OUT, sheet VGA_A_04/RFIN
(unnamed): sheet RX_LNA_A_05/RF_OUT, sheet VGA_A_05/RFIN
(unnamed): sheet RX_LNA_A_06/RF_OUT, sheet VGA_A_06/RFIN
(unnamed): sheet RX_LNA_A_07/RF_OUT, sheet VGA_A_07/RFIN
(unnamed): sheet RX_LNA_A_00/RF_IN, sheet U_Switch_SPDT/RFC
(unnamed): sheet RX_LNA_A_00/RF_OUT, sheet SE_Diff_RX_00/SE
(unnamed): sheet TX_PA_00/RF_OUT, sheet PA_A_00/RF_IN
(unnamed): sheet TX_PA_01/RF_OUT, sheet PA_A_01/RF_IN
(unnamed): sheet TX_PA_02/RF_OUT, sheet PA_A_02/RF_IN
(unnamed): sheet TX_PA_03/RF_OUT, sheet PA_A_03/RF_IN
(unnamed): sheet TX_PA_04/RF_OUT, sheet PA_A_04/RF_IN
(unnamed): sheet TX_PA_05/RF_OUT, sheet PA_A_05/RF_IN
(unnamed): sheet TX_PA_06/RF_OUT, sheet PA_A_06/RF_IN
(unnamed): sheet TX_PA_07/RF_OUT, sheet PA_A_07/RF_IN
(unnamed): sheet PA_A_00/RF_OUT, sheet U_Switch_SPDT/RFC
(unnamed): sheet PA_A_01/RF_OUT, sheet TX_Final_Amp_01/RF_IN
(unnamed): sheet PA_A_02/RF_OUT, sheet TX_Final_Amp_02/RF_IN
(unnamed): sheet PA_A_03/RF_OUT, sheet TX_Final_Amp_03/RF_IN
(unnamed): sheet PA_A_04/RF_OUT, sheet TX_Final_Amp_04/RF_IN
(unnamed): sheet PA_A_05/RF_OUT, sheet TX_Final_Amp_05/RF_IN
(unnamed): sheet PA_A_06/RF_OUT, sheet TX_Final_Amp_06/RF_IN
(unnamed): sheet PA_A_07/RF_OUT, sheet TX_Final_Amp_07/RF_IN
(unnamed): sheet U_Status_LEDs/1V8_Out, sheet U_Trigger_Input/1V8_In
(unnamed): sheet SE_Diff_RX_01/SE, sheet VGA_B_01/RFOUT
(unnamed): sheet SE_Diff_RX_02/SE, sheet VGA_B_02/RFOUT
(unnamed): sheet SE_Diff_RX_03/SE, sheet VGA_B_03/RFOUT
(unnamed): sheet SE_Diff_RX_04/SE, sheet VGA_B_04/RFOUT
(unnamed): sheet SE_Diff_RX_05/SE, sheet VGA_B_05/RFOUT
(unnamed): sheet SE_Diff_RX_06/SE, sheet VGA_B_06/RFOUT
(unnamed): sheet SE_Diff_RX_07/SE, sheet VGA_B_07/RFOUT
(unnamed): sheet RX_LNA_B_01/RF_IN, sheet VGA_A_01/RFOUT
(unnamed): sheet RX_LNA_B_01/RF_OUT, sheet VGA_B_01/RFIN
(unnamed): sheet RX_LNA_B_02/RF_IN, sheet VGA_A_02/RFOUT
(unnamed): sheet RX_LNA_B_02/RF_OUT, sheet VGA_B_02/RFIN
(unnamed): sheet RX_LNA_B_03/RF_IN, sheet VGA_A_03/RFOUT
(unnamed): sheet RX_LNA_B_03/RF_OUT, sheet VGA_B_03/RFIN
(unnamed): sheet RX_LNA_B_04/RF_IN, sheet VGA_A_04/RFOUT
(unnamed): sheet RX_LNA_B_04/RF_OUT, sheet VGA_B_04/RFIN
(unnamed): sheet RX_LNA_B_05/RF_IN, sheet VGA_A_05/RFOUT
(unnamed): sheet RX_LNA_B_05/RF_OUT, sheet VGA_B_05/RFIN
(unnamed): sheet RX_LNA_B_06/RF_IN, sheet VGA_A_06/RFOUT
(unnamed): sheet RX_LNA_B_06/RF_OUT, sheet VGA_B_06/RFIN
(unnamed): sheet RX_LNA_B_07/RF_IN, sheet VGA_A_07/RFOUT
(unnamed): sheet RX_LNA_B_07/RF_OUT, sheet VGA_B_07/RFIN
(unnamed): sheet TX_Final_Amp_01/RF_OUT, sheet PMA_01/RFIN
(unnamed): sheet TX_Final_Amp_02/RF_OUT, sheet PMA_02/RFIN
(unnamed): sheet TX_Final_Amp_03/RF_OUT, sheet PMA_03/RFIN
(unnamed): sheet TX_Final_Amp_04/RF_OUT, sheet PMA_04/RFIN
(unnamed): sheet TX_Final_Amp_05/RF_OUT, sheet PMA_05/RFIN
(unnamed): sheet TX_Final_Amp_06/RF_OUT, sheet PMA_06/RFIN
(unnamed): sheet TX_Final_Amp_07/RF_OUT, sheet PMA_07/RFIN

## Buses and harness runs
harness ATT_CTRL = sheet VGA_A_01/ATT_CTRL
harness ATT_CTRL = sheet VGA_A_02/ATT_CTRL
harness ATT_CTRL = sheet VGA_A_03/ATT_CTRL
harness ATT_CTRL = sheet VGA_A_04/ATT_CTRL
harness ATT_CTRL = sheet VGA_A_05/ATT_CTRL
harness ATT_CTRL = sheet VGA_A_06/ATT_CTRL
harness ATT_CTRL = sheet VGA_A_07/ATT_CTRL
harness ATT_CTRL = sheet VGA_B_01/ATT_CTRL
harness ATT_CTRL = sheet VGA_B_02/ATT_CTRL
harness ATT_CTRL = sheet VGA_B_03/ATT_CTRL
harness ATT_CTRL = sheet VGA_B_04/ATT_CTRL
harness ATT_CTRL = sheet VGA_B_05/ATT_CTRL
harness ATT_CTRL = sheet VGA_B_06/ATT_CTRL
harness ATT_CTRL = sheet VGA_B_07/ATT_CTRL

## Layout directives
differential pair: ADC_00_N, ADC_00_P, ADC_01_N, ADC_01_P, ADC_02_N, ADC_02_P, ADC_03_N, ADC_03_P, ADC_04_N, ADC_04_P, ADC_05_N, ADC_05_P, ADC_06_N, ADC_06_P, ADC_07_N, ADC_07_P, DAC_00_N, DAC_00_P, DAC_01_N, DAC_01_P, DAC_02_N, DAC_02_P, DAC_03_N, DAC_03_P, DAC_04_N, DAC_04_P, DAC_05_N, DAC_05_P, DAC_06_N, DAC_06_P, DAC_07_N, DAC_07_P
net class Diff: ADC_00_N, ADC_00_P, ADC_01_N, ADC_01_P, ADC_02_N, ADC_02_P, ADC_03_N, ADC_03_P, ADC_04_N, ADC_04_P, ADC_05_N, ADC_05_P, ADC_06_N, ADC_06_P, ADC_07_N, ADC_07_P, DAC_00_N, DAC_00_P, DAC_01_N, DAC_01_P, DAC_02_N, DAC_02_P, DAC_03_N, DAC_03_P, DAC_04_N, DAC_04_P, DAC_05_N, DAC_05_P, DAC_06_N, DAC_06_P, DAC_07_N, DAC_07_P
net class GCPW_50: (no net found under the mark), NetJ_gNB_RX_S, NetJ_gNB_TX_S, NetJ_RX_0_S, NetJ_RX_1_S, NetJ_RX_2_S, NetJ_RX_3_S, NetJ_RX_4_S, NetJ_RX_5_S, NetJ_RX_6_S, NetJ_RX_7_S, NetJ_TX_0_S, NetJ_TX_1_S, NetJ_TX_2_S, NetJ_TX_3_S, NetJ_TX_4_S, NetJ_TX_5_S, NetJ_TX_6_S, NetJ_TX_7_S

## Notes on the sheet
- 10: RF1
- 01: RF2
- Length match all the TX lines and RX Lines
- Place vias on all major GND pads

## Library data of the parts
J_gNB_RX J_gNB_TX J_RX_0-J_RX_7 J_TX_0-J_TX_7 = SMA Connector SF2921-61345 GCPW 8.8/4: SMA Female Solderless PCB Compression Mount Connector, 2 Hole, with 4.76mm Screws; MF: Samtec; MP: SMA-J-P-H-ST-EM1; Price: None; SnapEDA_Link: https://www.snapeda.com/parts/SMA-J-P-H-ST-EM1/Samtec%20Inc./view-part/?ref=snap; Package: None; Availability: Unavailable; Value: *
SH18 = 2118716-2: MP: 2118728-2; Package: None; Price: None; Value: *; Availability: Unavailable
SH1-SH17 SH19-SH31 = 2118728-2: Package: None; Price: None; Value: *; MP: 2118728-2; Availability: Unavailable